# Altium schematic sheet ATxmega64A4U.SchDoc
size A3
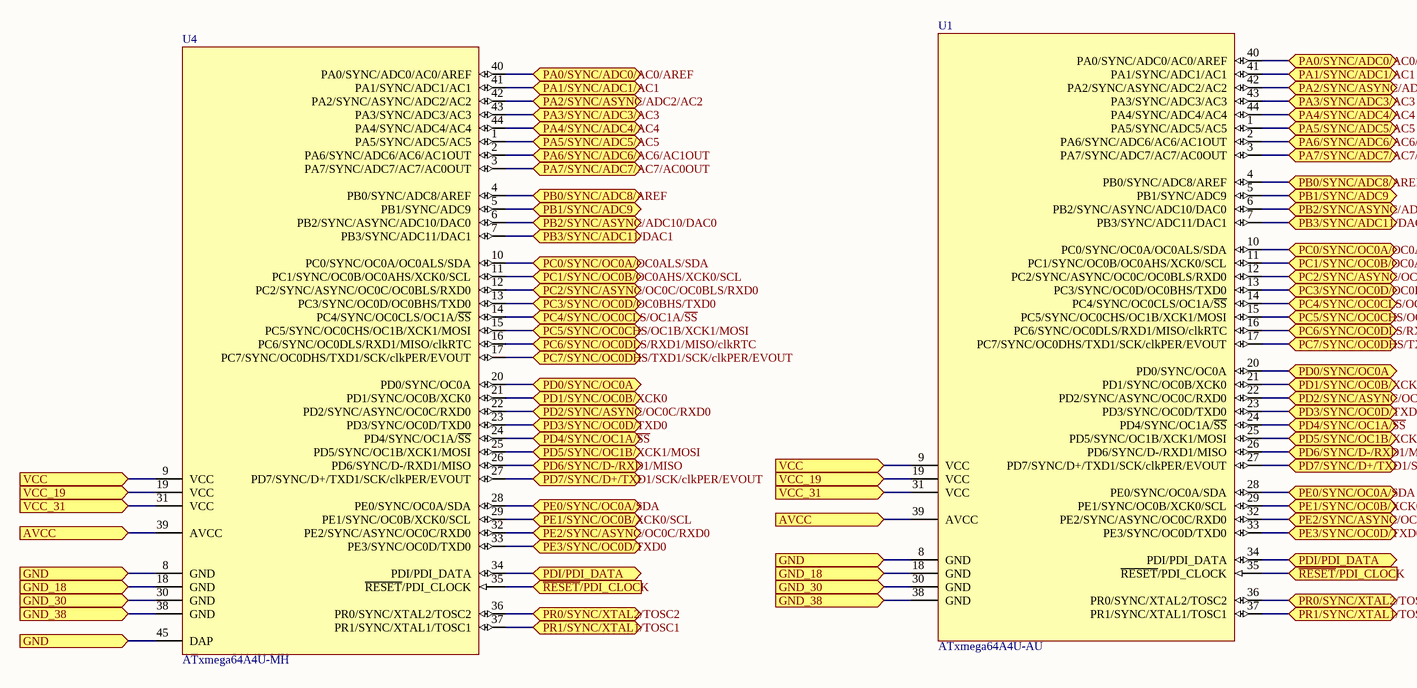
[diagram p0: ATxmega64A4U.SchDoc]

## Parts
U1  ATxmega64A4U-AU  [44A_N]
U4  ATxmega64A4U-MH  [44M1_N]

## Ports
AVCC, GND, GND_18, GND_30, GND_38, PA0/SYNC/ADC0/AC0/AREF (bidir), PA1/SYNC/ADC1/AC1 (bidir), PA2/SYNC/ASYNC/ADC2/AC2 (bidir), PA3/SYNC/ADC3/AC3 (bidir), PA4/SYNC/ADC4/AC4 (bidir), PA5/SYNC/ADC5/AC5 (bidir), PA6/SYNC/ADC6/AC6/AC1OUT (bidir), PA7/SYNC/ADC7/AC7/AC0OUT (bidir), PB0/SYNC/ADC8/AREF (bidir), PB1/SYNC/ADC9 (bidir), PB2/SYNC/ASYNC/ADC10/DAC0 (bidir), PB3/SYNC/ADC11/DAC1 (bidir), PC0/SYNC/OC0A/OC0ALS/SDA (bidir), PC1/SYNC/OC0B/OC0AHS/XCK0/SCL (bidir), PC2/SYNC/ASYNC/OC0C/OC0BLS/RXD0 (bidir), PC3/SYNC/OC0D/OC0BHS/TXD0 (bidir), PC4/SYNC/OC0CLS/OC1A/~{SS} (bidir), PC5/SYNC/OC0CHS/OC1B/XCK1/MOSI (bidir), PC6/SYNC/OC0DLS/RXD1/MISO/clkRTC (bidir), PC7/SYNC/OC0DHS/TXD1/SCK/clkPER/EVOUT (bidir), PD0/SYNC/OC0A (bidir), PD1/SYNC/OC0B/XCK0 (bidir), PD2/SYNC/ASYNC/OC0C/RXD0 (bidir), PD3/SYNC/OC0D/TXD0 (bidir), PD4/SYNC/OC1A/~{SS} (bidir), PD5/SYNC/OC1B/XCK1/MOSI (bidir), PD6/SYNC/D-/RXD1/MISO (bidir), PD7/SYNC/D+/TXD1/SCK/clkPER/EVOUT (bidir), PDI/PDI_DATA (bidir), PE0/SYNC/OC0A/SDA (bidir), PE1/SYNC/OC0B/XCK0/SCL (bidir), PE2/SYNC/ASYNC/OC0C/RXD0 (bidir), PE3/SYNC/OC0D/TXD0 (bidir), PR0/SYNC/XTAL2/TOSC2 (bidir), PR1/SYNC/XTAL1/TOSC1 (bidir), VCC, VCC_19, VCC_31, ~{RESET}/PDI_CLOCK (in)

## Nets
AVCC: U1.39(AVCC) U4.39(AVCC) ; port AVCC
GND: U1.8(GND) U4.8(GND) U4.45(DAP) ; port GND
GND_18: U1.18(GND) U4.18(GND) ; port GND_18
GND_30: U1.30(GND) U4.30(GND) ; port GND_30
GND_38: U1.38(GND) U4.38(GND) ; port GND_38
PA0/SYNC/ADC0/AC0/AREF: U1.40(PA0/SYNC/ADC0/AC0/AREF) U4.40(PA0/SYNC/ADC0/AC0/AREF) ; port PA0/SYNC/ADC0/AC0/AREF
PA1/SYNC/ADC1/AC1: U1.41(PA1/SYNC/ADC1/AC1) U4.41(PA1/SYNC/ADC1/AC1) ; port PA1/SYNC/ADC1/AC1
PA2/SYNC/ASYNC/ADC2/AC2: U1.42(PA2/SYNC/ASYNC/ADC2/AC2) U4.42(PA2/SYNC/ASYNC/ADC2/AC2) ; port PA2/SYNC/ASYNC/ADC2/AC2
PA3/SYNC/ADC3/AC3: U1.43(PA3/SYNC/ADC3/AC3) U4.43(PA3/SYNC/ADC3/AC3) ; port PA3/SYNC/ADC3/AC3
PA4/SYNC/ADC4/AC4: U1.44(PA4/SYNC/ADC4/AC4) U4.44(PA4/SYNC/ADC4/AC4) ; port PA4/SYNC/ADC4/AC4
PA5/SYNC/ADC5/AC5: U1.1(PA5/SYNC/ADC5/AC5) U4.1(PA5/SYNC/ADC5/AC5) ; port PA5/SYNC/ADC5/AC5
PA6/SYNC/ADC6/AC6/AC1OUT: U1.2(PA6/SYNC/ADC6/AC6/AC1OUT) U4.2(PA6/SYNC/ADC6/AC6/AC1OUT) ; port PA6/SYNC/ADC6/AC6/AC1OUT
PA7/SYNC/ADC7/AC7/AC0OUT: U1.3(PA7/SYNC/ADC7/AC7/AC0OUT) U4.3(PA7/SYNC/ADC7/AC7/AC0OUT) ; port PA7/SYNC/ADC7/AC7/AC0OUT
PB0/SYNC/ADC8/AREF: U1.4(PB0/SYNC/ADC8/AREF) U4.4(PB0/SYNC/ADC8/AREF) ; port PB0/SYNC/ADC8/AREF
PB1/SYNC/ADC9: U1.5(PB1/SYNC/ADC9) U4.5(PB1/SYNC/ADC9) ; port PB1/SYNC/ADC9
PB2/SYNC/ASYNC/ADC10/DAC0: U1.6(PB2/SYNC/ASYNC/ADC10/DAC0) U4.6(PB2/SYNC/ASYNC/ADC10/DAC0) ; port PB2/SYNC/ASYNC/ADC10/DAC0
PB3/SYNC/ADC11/DAC1: U1.7(PB3/SYNC/ADC11/DAC1) U4.7(PB3/SYNC/ADC11/DAC1) ; port PB3/SYNC/ADC11/DAC1
PC0/SYNC/OC0A/OC0ALS/SDA: U1.10(PC0/SYNC/OC0A/OC0ALS/SDA) U4.10(PC0/SYNC/OC0A/OC0ALS/SDA) ; port PC0/SYNC/OC0A/OC0ALS/SDA
PC1/SYNC/OC0B/OC0AHS/XCK0/SCL: U1.11(PC1/SYNC/OC0B/OC0AHS/XCK0/SCL) U4.11(PC1/SYNC/OC0B/OC0AHS/XCK0/SCL) ; port PC1/SYNC/OC0B/OC0AHS/XCK0/SCL
PC2/SYNC/ASYNC/OC0C/OC0BLS/RXD0: U1.12(PC2/SYNC/ASYNC/OC0C/OC0BLS/RXD0) U4.12(PC2/SYNC/ASYNC/OC0C/OC0BLS/RXD0) ; port PC2/SYNC/ASYNC/OC0C/OC0BLS/RXD0
PC3/SYNC/OC0D/OC0BHS/TXD0: U1.13(PC3/SYNC/OC0D/OC0BHS/TXD0) U4.13(PC3/SYNC/OC0D/OC0BHS/TXD0) ; port PC3/SYNC/OC0D/OC0BHS/TXD0
PC4/SYNC/OC0CLS/OC1A/~{SS}: U1.14(PC4/SYNC/OC0CLS/OC1A/~{SS}) U4.14(PC4/SYNC/OC0CLS/OC1A/~{SS}) ; port PC4/SYNC/OC0CLS/OC1A/~{SS}
PC5/SYNC/OC0CHS/OC1B/XCK1/MOSI: U1.15(PC5/SYNC/OC0CHS/OC1B/XCK1/MOSI) U4.15(PC5/SYNC/OC0CHS/OC1B/XCK1/MOSI) ; port PC5/SYNC/OC0CHS/OC1B/XCK1/MOSI
PC6/SYNC/OC0DLS/RXD1/MISO/clkRTC: U1.16(PC6/SYNC/OC0DLS/RXD1/MISO/clkRTC) U4.16(PC6/SYNC/OC0DLS/RXD1/MISO/clkRTC) ; port PC6/SYNC/OC0DLS/RXD1/MISO/clkRTC
PC7/SYNC/OC0DHS/TXD1/SCK/clkPER/EVOUT: U1.17(PC7/SYNC/OC0DHS/TXD1/SCK/clkPER/EVOUT) U4.17(PC7/SYNC/OC0DHS/TXD1/SCK/clkPER/EVOUT) ; port PC7/SYNC/OC0DHS/TXD1/SCK/clkPER/EVOUT
PD0/SYNC/OC0A: U1.20(PD0/SYNC/OC0A) U4.20(PD0/SYNC/OC0A) ; port PD0/SYNC/OC0A
PD1/SYNC/OC0B/XCK0: U1.21(PD1/SYNC/OC0B/XCK0) U4.21(PD1/SYNC/OC0B/XCK0) ; port PD1/SYNC/OC0B/XCK0
PD2/SYNC/ASYNC/OC0C/RXD0: U1.22(PD2/SYNC/ASYNC/OC0C/RXD0) U4.22(PD2/SYNC/ASYNC/OC0C/RXD0) ; port PD2/SYNC/ASYNC/OC0C/RXD0
PD3/SYNC/OC0D/TXD0: U1.23(PD3/SYNC/OC0D/TXD0) U4.23(PD3/SYNC/OC0D/TXD0) ; port PD3/SYNC/OC0D/TXD0
PD4/SYNC/OC1A/~{SS}: U1.24(PD4/SYNC/OC1A/~{SS}) U4.24(PD4/SYNC/OC1A/~{SS}) ; port PD4/SYNC/OC1A/~{SS}
PD5/SYNC/OC1B/XCK1/MOSI: U1.25(PD5/SYNC/OC1B/XCK1/MOSI) U4.25(PD5/SYNC/OC1B/XCK1/MOSI) ; port PD5/SYNC/OC1B/XCK1/MOSI
PD6/SYNC/D-/RXD1/MISO: U1.26(PD6/SYNC/D-/RXD1/MISO) U4.26(PD6/SYNC/D-/RXD1/MISO) ; port PD6/SYNC/D-/RXD1/MISO
PD7/SYNC/D+/TXD1/SCK/clkPER/EVOUT: U1.27(PD7/SYNC/D+/TXD1/SCK/clkPER/EVOUT) U4.27(PD7/SYNC/D+/TXD1/SCK/clkPER/EVOUT) ; port PD7/SYNC/D+/TXD1/SCK/clkPER/EVOUT
PDI/PDI_DATA: U1.34(PDI/PDI_DATA) U4.34(PDI/PDI_DATA) ; port PDI/PDI_DATA
PE0/SYNC/OC0A/SDA: U1.28(PE0/SYNC/OC0A/SDA) U4.28(PE0/SYNC/OC0A/SDA) ; port PE0/SYNC/OC0A/SDA
PE1/SYNC/OC0B/XCK0/SCL: U1.29(PE1/SYNC/OC0B/XCK0/SCL) U4.29(PE1/SYNC/OC0B/XCK0/SCL) ; port PE1/SYNC/OC0B/XCK0/SCL
PE2/SYNC/ASYNC/OC0C/RXD0: U1.32(PE2/SYNC/ASYNC/OC0C/RXD0) U4.32(PE2/SYNC/ASYNC/OC0C/RXD0) ; port PE2/SYNC/ASYNC/OC0C/RXD0
PE3/SYNC/OC0D/TXD0: U1.33(PE3/SYNC/OC0D/TXD0) U4.33(PE3/SYNC/OC0D/TXD0) ; port PE3/SYNC/OC0D/TXD0
PR0/SYNC/XTAL2/TOSC2: U1.36(PR0/SYNC/XTAL2/TOSC2) U4.36(PR0/SYNC/XTAL2/TOSC2) ; port PR0/SYNC/XTAL2/TOSC2
PR1/SYNC/XTAL1/TOSC1: U1.37(PR1/SYNC/XTAL1/TOSC1) U4.37(PR1/SYNC/XTAL1/TOSC1) ; port PR1/SYNC/XTAL1/TOSC1
~{RESET}/PDI_CLOCK: U1.35(~{RESET}/PDI_CLOCK) U4.35(~{RESET}/PDI_CLOCK) ; port ~{RESET}/PDI_CLOCK
VCC: U1.9(VCC) U4.9(VCC) ; port VCC
VCC_19: U1.19(VCC) U4.19(VCC) ; port VCC_19
VCC_31: U1.31(VCC) U4.31(VCC) ; port VCC_31

## Library data of the parts
U1 = CMP-0094-00068-1: 8/16-bit AVR XMEGA A4U Microcontroller, 1.6-3.6V, 32MHz, 64K + 4KB Flash, 2K EEPROM, 4K SRAM, 44-pin TQFP, Industrial Grade (-40°C to 85°C); PackageReference: 44A; PackageVersion: revC, Oct-2010; Code_JEDEC: MS-026-ACB; PackageDescription: 44-Pin Plastic Thin Profile Quad Flat Pack, 10 x 10 x 1.0 mm Body, 0.8 mm Pitch (TQFP); DatasheetVersion: revB, Dec-2011; ComponentLink2URL: http://www.atmel.com/dyn/resources/prod_documents/doc8387.pdf; ComponentLink1Description: Manufacturer URL; ComponentLink1URL: http://www.atmel.com/; ComponentLink2Description: ATxmega16A4U/32A4U/64A4U/128A4U Datasheet
U4 = CMP-0094-00055-1: 8/16-bit AVR XMEGA A4U Microcontroller, 1.6-3.6V, 32MHz, 64K + 4KB Flash, 2K EEPROM, 4K SRAM, 44-pin VQFN, Industrial Grade (-40°C to 85°C); PackageReference: 44M1; ComponentLink1Description: Manufacturer URL; Code_JEDEC: MO-220-VKKD-1; PackageDescription: 44-Pin Plastic Very Thin Quad Flat No-Lead Package, 7 x 7 x 1.0 mm Body, 0.5 mm Pitch (VQFN), 5.2 mm Exposed Pad; DatasheetVersion: revB, Dec-2011; ComponentLink2URL: http://www.atmel.com/dyn/resources/prod_documents/doc8387.pdf; PackageVersion: revH, Sep-2008; ComponentLink1URL: http://www.atmel.com/; ComponentLink2Description: ATxmega16A4U/32A4U/64A4U/128A4U Datasheet